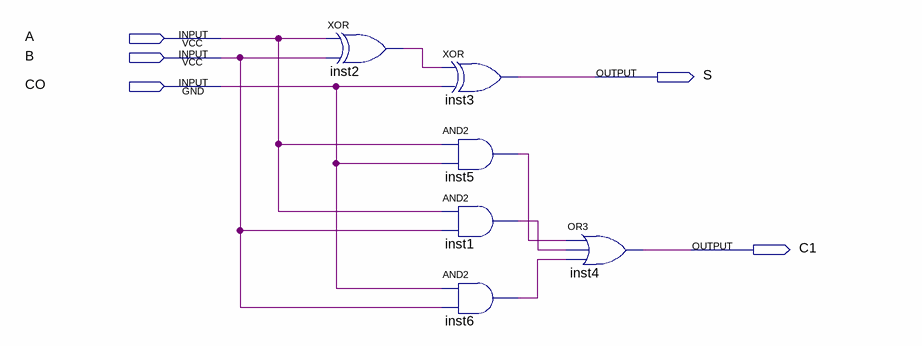
[diagram p0: schematic sheet]
// Quartus schematic add1.bdf as structural Verilog: 6 symbols, 5 pins
module add1 (
  input  A,
  input  B,
  input  CO,
  output S,
  output C1
);

  wire inst1_out, inst2_out, inst5_out, inst6_out;

  xor inst2 (inst2_out, A, B);
  xor inst3 (S, inst2_out, CO);
  and inst5 (inst5_out, A, CO);
  and inst1 (inst1_out, A, B);
  and inst6 (inst6_out, CO, B);
  or inst4 (C1, inst5_out, inst1_out, inst6_out);
endmodule
